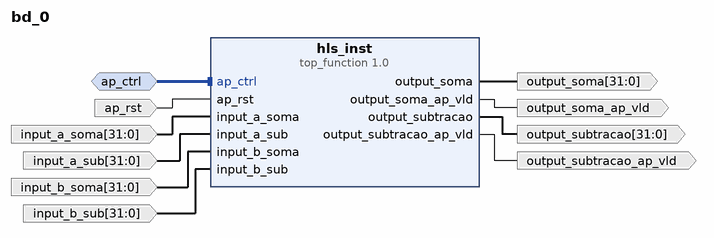
[diagram p0: block diagram of the top level]
# Vivado block design bd_0, xc7z007sclg400-1, Vivado 2024.2
create_bd_design bd_0

create_bd_intf_port -mode Slave -vlnv xilinx.com:interface:acc_handshake_rtl:1.0 ap_ctrl
create_bd_port -dir I -type rst ap_rst
set_property -dict {CONFIG.POLARITY ACTIVE_HIGH} [get_bd_ports ap_rst]
create_bd_port -dir I -from 31 -to 0 -type data input_a_soma
create_bd_port -dir I -from 31 -to 0 -type data input_a_sub
create_bd_port -dir I -from 31 -to 0 -type data input_b_soma
create_bd_port -dir I -from 31 -to 0 -type data input_b_sub
create_bd_port -dir O -from 31 -to 0 -type data output_soma
create_bd_port -dir O output_soma_ap_vld
create_bd_port -dir O -from 31 -to 0 -type data output_subtracao
create_bd_port -dir O output_subtracao_ap_vld

create_bd_cell -type ip -vlnv xilinx.com:hls:top_function:1.0 hls_inst

# ---- connections ----

connect_bd_intf_net -intf_net ap_ctrl_0_1 [get_bd_intf_ports ap_ctrl] [get_bd_intf_pins hls_inst/ap_ctrl]
connect_bd_net -net ap_rst_0_1 [get_bd_ports ap_rst] [get_bd_pins hls_inst/ap_rst]
connect_bd_net [get_bd_pins hls_inst/output_soma] [get_bd_ports output_soma]
connect_bd_net [get_bd_pins hls_inst/output_soma_ap_vld] [get_bd_ports output_soma_ap_vld]
connect_bd_net [get_bd_pins hls_inst/output_subtracao] [get_bd_ports output_subtracao]
connect_bd_net [get_bd_pins hls_inst/output_subtracao_ap_vld] [get_bd_ports output_subtracao_ap_vld]
connect_bd_net -net input_a_soma_0_1 [get_bd_ports input_a_soma] [get_bd_pins hls_inst/input_a_soma]
connect_bd_net -net input_a_sub_0_1 [get_bd_ports input_a_sub] [get_bd_pins hls_inst/input_a_sub]
connect_bd_net -net input_b_soma_0_1 [get_bd_ports input_b_soma] [get_bd_pins hls_inst/input_b_soma]
connect_bd_net -net input_b_sub_0_1 [get_bd_ports input_b_sub] [get_bd_pins hls_inst/input_b_sub]

validate_bd_design
save_bd_design
